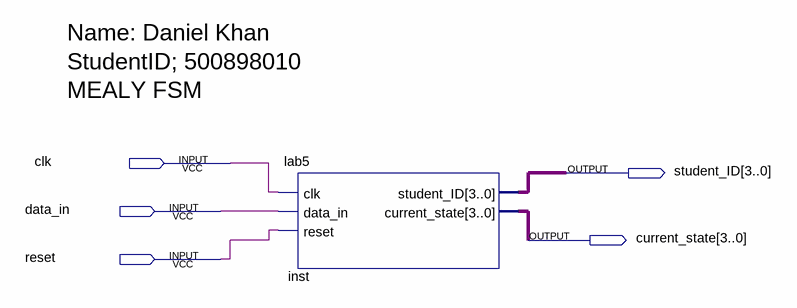
[diagram p0: schematic sheet]
// Quartus schematic MealyFSMschem.bdf as structural Verilog: 1 symbols, 5 pins
module MealyFSMschem (
  input  clk,
  input  data_in,
  input  reset,
  output [3:0] student_ID,
  output [3:0] current_state
);

  lab5 inst (.clk(clk), .data_in(data_in), .reset(reset), .student_ID(student_ID), .current_state(current_state));

  // Notes on the sheet:
  //   Name: Daniel Khan
  //   StudentID; 500898010
  //   MEALY FSM
endmodule
